# Altium project Rectifire_PFC_Solar.PrjPcb
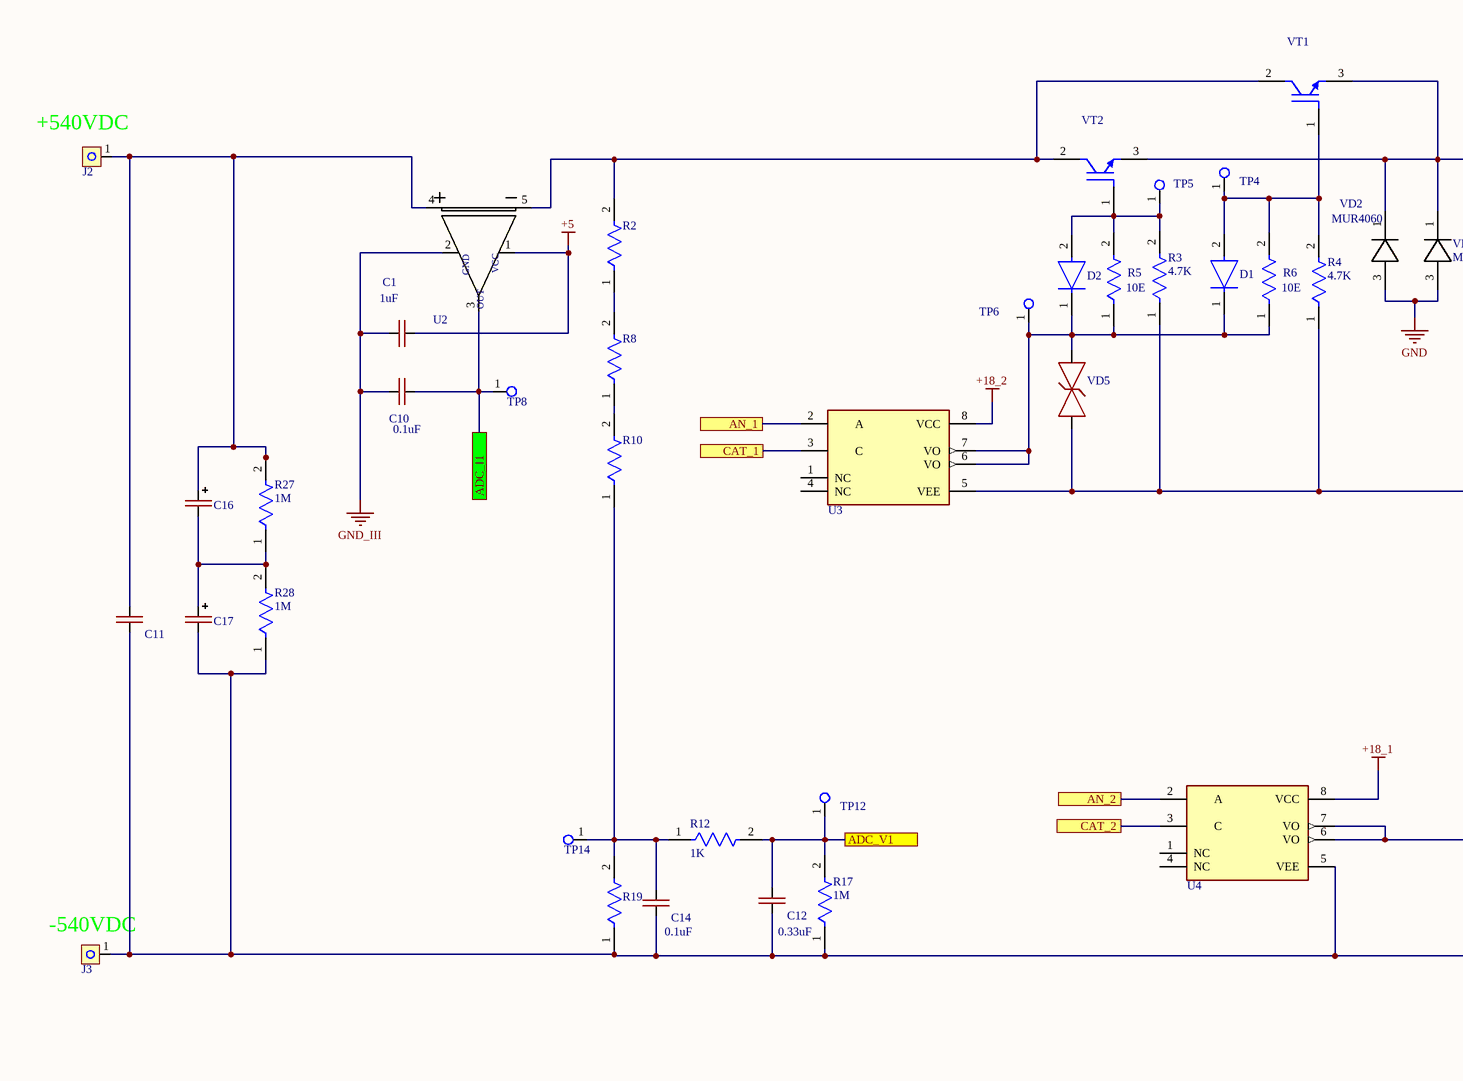
[diagram p0: Rectifire_PFC_Solar.SchDoc, top left]
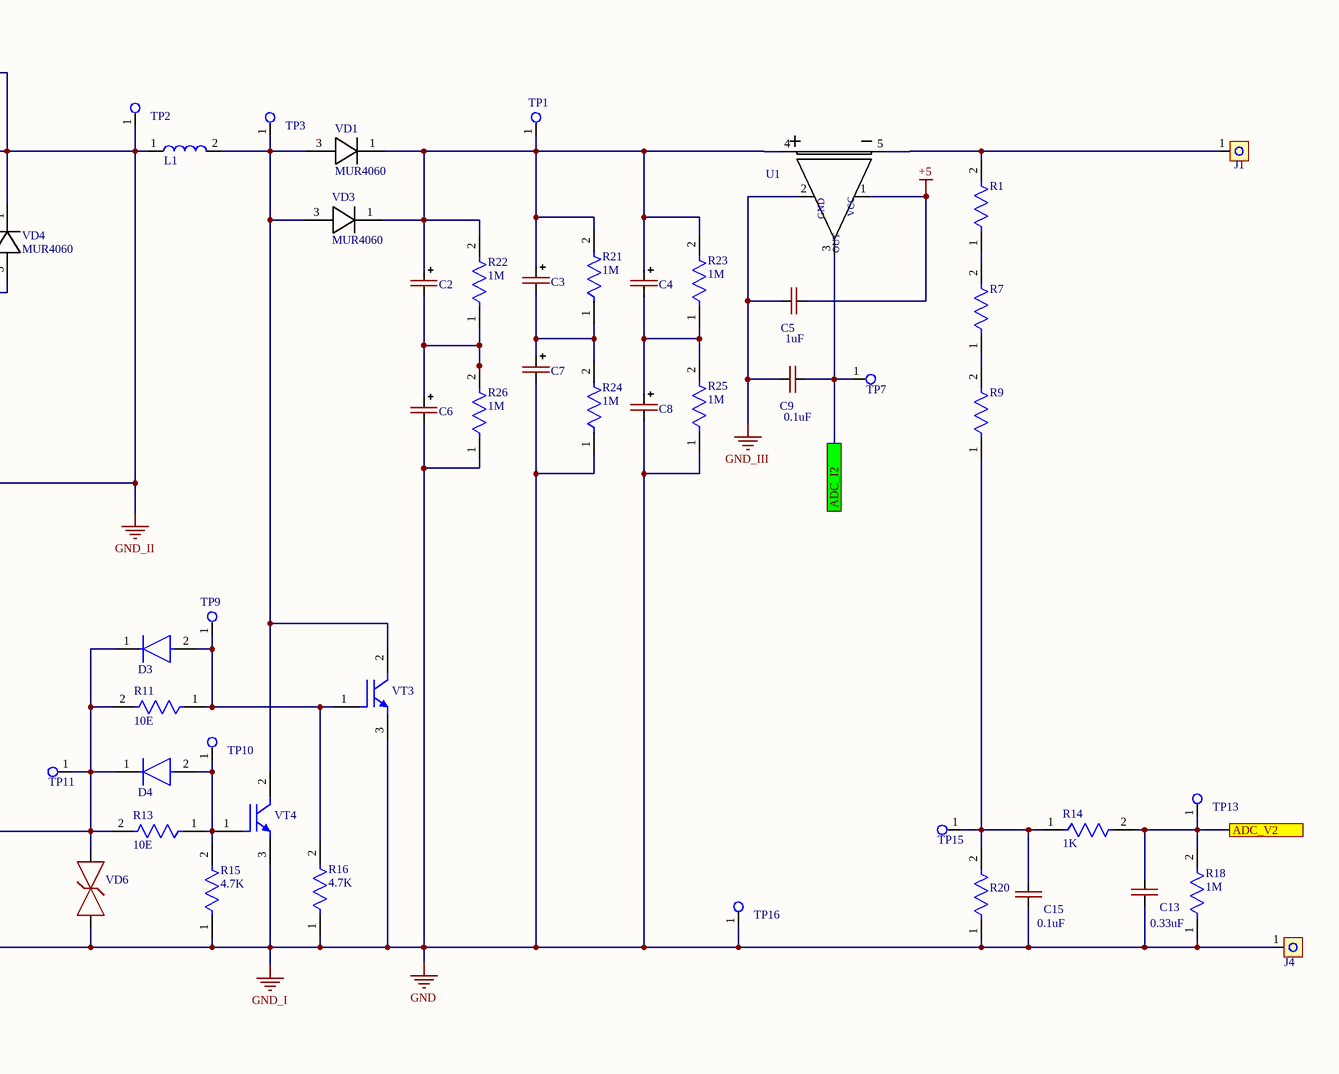
[diagram p1: Rectifire_PFC_Solar.SchDoc, top right]
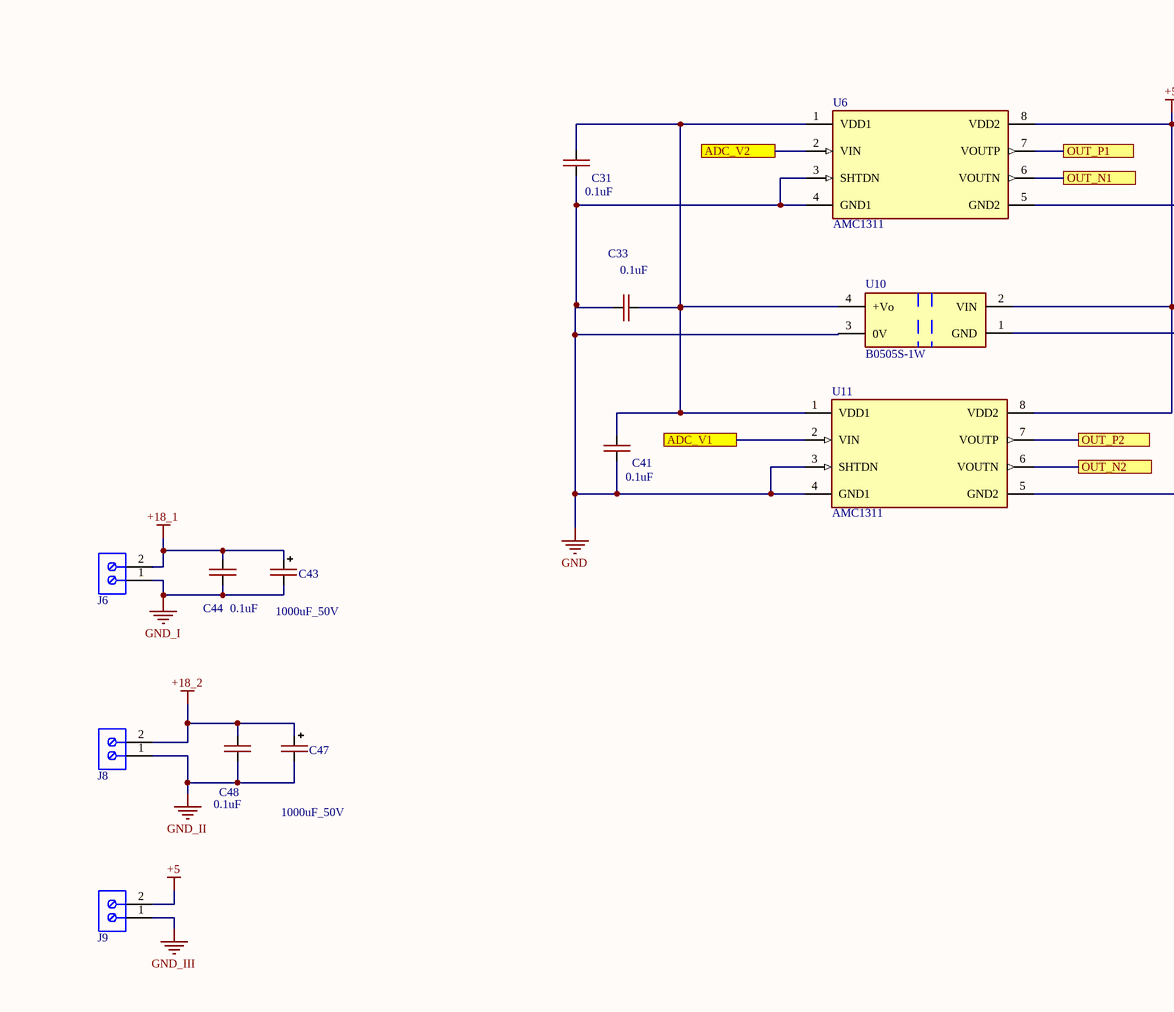
[diagram p2: Rectifire_PFC_Solar.SchDoc, bottom left]
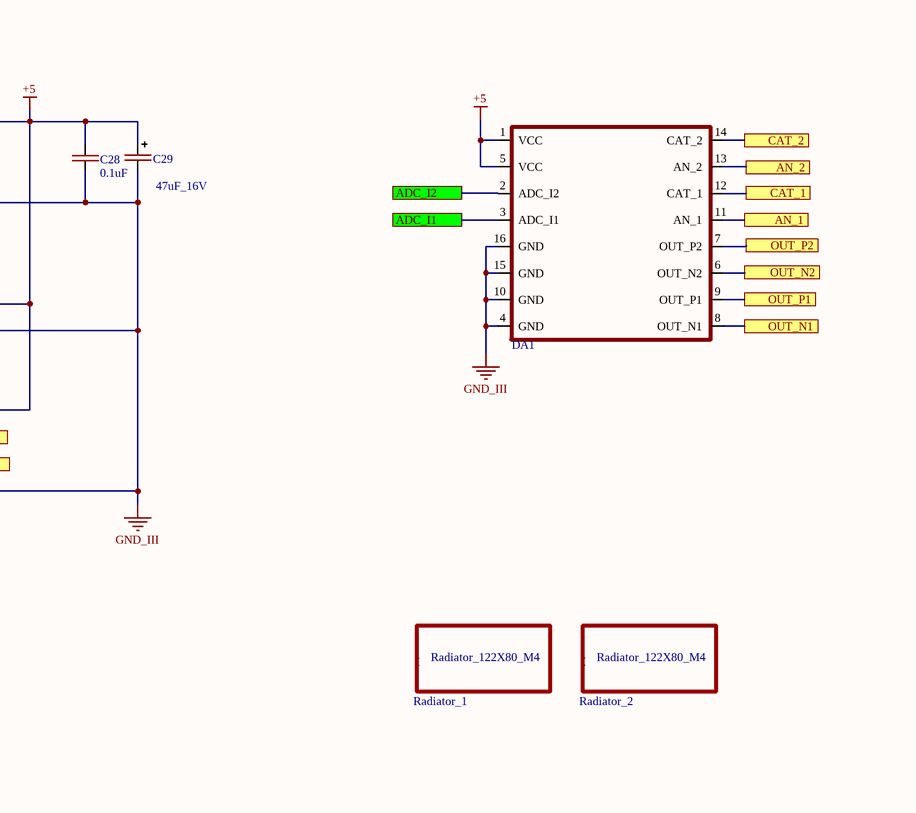
[diagram p3: Rectifire_PFC_Solar.SchDoc, bottom right]
1 sheet, 102 parts. Net scope: flat (ports and power ports of the same name join across sheets).
Board file: Rectifire_PFC_Solar.PcbDoc

## Sheet Rectifire_PFC_Solar.SchDoc
size A0; SheetNumber: 1; SheetTotal: 1; SPICEModelCacheFPQAHQWD: <root> / <DocumentId>FPQAHQWD</DocumentId> / </root>

### Parts
C1  1uF  [CAP-0805]
C2  CAP-POLAR  [CAP 100uF_500V 22x40mm]  (value not drawn)
C3  CAP-POLAR  [CAP 100uF_500V 22x40mm]  (value not drawn)
C4  CAP-POLAR  [CAP 100uF_500V 22x40mm]  (value not drawn)
C5  1uF  [CAP-0805]
C6  CAP-POLAR  [CAP 100uF_500V 22x40mm]  (value not drawn)
C7  CAP-POLAR  [CAP 100uF_500V 22x40mm]  (value not drawn)
C8  CAP-POLAR  [CAP 100uF_500V 22x40mm]  (value not drawn)
C9  0.1uF  [CAP-0805]
C10  0.1uF  [CAP-0805]
C11  CAP-NON-POLAR  [CAP_4.7uF_630V]  (value not drawn)
C12  0.33uF  [CAP-0805]
C13  0.33uF  [CAP-0805]
C14  0.1uF  [CAP-0805]
C15  0.1uF  [CAP-0805]
C16  CAP-POLAR  [CAP_POL_36X60]  (value not drawn)
C17  CAP-POLAR  [CAP_POL_36X60]  (value not drawn)
C28  0.1uF  [CAP-0805]
C29  47uF_16V  [CAP-TAN-D]
C31  0.1uF  [CAP-0805]
C33  0.1uF  [CAP-0805]
C41  0.1uF  [CAP-0805]
C43  1000uF_50V  [CAPPOL-16x25]
C44  0.1uF  [CAP-0805]
C47  1000uF_50V  [CAPPOL-16x25]
C48  0.1uF  [CAP-0805]
D1  US1G  [DO-214AA]  (value not drawn)
D2  US1G  [DO-214AA]  (value not drawn)
D3  US1G  [DO-214AA]  (value not drawn)
D4  US1G  [DO-214AA]  (value not drawn)
DA1  BOARD_PFC  [BOARD_PFC]  (value not drawn)
J1  MG_136_HT  [Conn_MEIGAN_MG136HT]  (value not drawn)
J2  MG_136_HT  [Conn_MEIGAN_MG136HT]  (value not drawn)
J3  MG_136_HT  [Conn_MEIGAN_MG136HT]  (value not drawn)
J4  MG_136_HT  [Conn_MEIGAN_MG136HT]  (value not drawn)
J6  691102710002  [691102710002]  (value not drawn)
J8  691102710002  [691102710002]  (value not drawn)
J9  691102710002  [691102710002]  (value not drawn)
L1  Coil  [30A_10uH]  (value not drawn)
R1  (no value)  [RES-2512]
R2  (no value)  [RES-2512]
R3  4.7K  [RES-0805]
R4  4.7K  [RES-0805]
R5  10E  [RES_SMD_1210_IPC_A]
R6  10E  [RES_SMD_1210_IPC_A]
R7  (no value)  [RES-2512]
R8  (no value)  [RES-2512]
R9  (no value)  [RES-2512]
R10  (no value)  [RES-2512]
R11  10E  [RES_SMD_1210_IPC_A]
R12  1K  [RES-0805]
R13  10E  [RES_SMD_1210_IPC_A]
R14  1K  [RES-0805]
R15  4.7K  [RES-0805]
R16  4.7K  [RES-0805]
R17  1M  [RES-0805]
R18  1M  [RES-0805]
R19  RES_1210  [RES_SMD_1210_IPC_B]  (value not drawn)
R20  RES_1210  [RES_SMD_1210_IPC_B]  (value not drawn)
R21  1M  [RES-2512]
R22  1M  [RES-2512]
R23  1M  [RES-2512]
R24  1M  [RES-2512]
R25  1M  [RES-2512]
R26  1M  [RES-2512]
R27  1M  [RES-2512]
R28  1M  [RES-2512]
Radiator_1  Radiator_122X80_M4  [Radiator_122X80_M4]  (value not drawn)
Radiator_2  Radiator_122X80_M4  [Radiator_122X80_M4]  (value not drawn)
TP1  Test_Point_PCB  [Test_Point]  (value not drawn)
TP2  Test_Point_PCB  [Test_Point]  (value not drawn)
TP3  Test_Point_PCB  [Test_Point]  (value not drawn)
TP4  Test_Point_PCB  [Test_Point]  (value not drawn)
TP5  Test_Point_PCB  [Test_Point]  (value not drawn)
TP6  Test_Point_PCB  [Test_Point]  (value not drawn)
TP7  Test_Point_PCB  [Test_Point]  (value not drawn)
TP8  Test_Point_PCB  [Test_Point]  (value not drawn)
TP9  Test_Point_PCB  [Test_Point]  (value not drawn)
TP10  Test_Point_PCB  [Test_Point]  (value not drawn)
TP11  Test_Point_PCB  [Test_Point]  (value not drawn)
TP12  Test_Point_PCB  [Test_Point]  (value not drawn)
TP13  Test_Point_PCB  [Test_Point]  (value not drawn)
TP14  Test_Point_PCB  [Test_Point]  (value not drawn)
TP15  Test_Point_PCB  [Test_Point]  (value not drawn)
TP16  Test_Point_PCB  [Test_Point]  (value not drawn)
U1  ACS758  [ACS758-100]  (value not drawn)
U2  ACS758  [ACS758-100]  (value not drawn)
U3  HCPL-3120  [HCPL-3120]  (value not drawn)
U4  HCPL-3120  [HCPL-3120]  (value not drawn)
U6  AMC1311  [FP-DWV0008A-MFG]
U10  B0505S-1W  [B0505S-1W]
U11  AMC1311  [FP-DWV0008A-MFG]
VD1  MUR4060  [TO-247-2]
VD2  MUR4060  [TO-247-2]
VD3  MUR4060  [TO-247-2]
VD4  MUR4060  [TO-247-2]
VD5  Suppressor  [DO-214AA]  (value not drawn)
VD6  Suppressor  [DO-214AA]  (value not drawn)
VT1  IGBT 60N120T  [TO-264-3]  (value not drawn)
VT2  IGBT 60N120T  [TO-264-3]  (value not drawn)
VT3  IGBT 60N120T  [TO-264-3]  (value not drawn)
VT4  IGBT 60N120T  [TO-264-3]  (value not drawn)

### Ports
ADC_I1, ADC_I2, ADC_V1, ADC_V2, AN_1, AN_2, CAT_1, CAT_2, OUT_N1, OUT_N2, OUT_P1, OUT_P2

### Nets
+5: C1.2 C5.2 C28.1 C29.1(+) DA1.1(VCC) DA1.5(VCC) J9.2 U1.1(+VCC) U2.1(+VCC) U6.8(VDD2) U10.2(VIN) U11.8(VDD2)
+18_1: C43.1(+) C44.2 J6.2 U4.8(VCC)
+18_2: C47.1(+) C48.2 J8.2 U3.8(VCC)
GND: C6.2(-) C7.2(-) C8.2(-) C11.1 C12.1 C13.1 C14.1 C15.1 C17.2(-) C31.1 C33.2 C41.1 C43.2(-) C44.1 J3.1 J4.1 J6.1 R15.1 R16.1 R17.1 R18.1 R19.1 R20.1 R24.1 R25.1 R26.1 R28.1 TP16.1(G9) U4.5(VEE) U6.3(SHTDN) U6.4(GND1) U10.3(0V) U11.3(SHTDN) U11.4(GND1) VD2.3 VD4.3 VD6.1(C) VT3.3(E) VT4.3(E)  [also labelled GND_I]
GND_II: C47.2(-) C48.1 J8.1 L1.1 R3.1 R4.1 TP2.1(G9) U3.5(VEE) VD2.1 VD4.1 VD5.1(C) VT1.3(E) VT2.3(E)
GND_III: C1.1 C5.1 C9.1 C10.1 C28.2 C29.2(-) DA1.4(GND) DA1.10(GND) DA1.15(GND) DA1.16(GND) J9.1 U1.2(GND) U2.2(GND) U6.5(GND2) U10.1(GND) U11.5(GND2)
NetC2_1: C2.1(+) C3.1(+) C4.1(+) R21.2 R22.2 R23.2 TP1.1(G9) U1.4(+IP) VD1.1 VD3.1
NetC2_2: C2.2(-) C6.1(+) R22.1 R26.2
NetC3_2: C3.2(-) C7.1(+) R21.1 R24.2
NetC4_2: C4.2(-) C8.1(+) R23.1 R25.2
NetC9_2: C9.2 DA1.2(ADC_I2) TP7.1(G9) U1.3(OUT) ; port ADC_I2
NetC10_2: C10.2 DA1.3(ADC_I1) TP8.1(G9) U2.3(OUT) ; port ADC_I1
NetC11_2: C11.2 C16.1(+) J2.1 R27.2 U2.4(+IP)
NetC12_2: C12.2 R12.2 R17.2 TP12.1(G9) U11.2(VIN) ; port ADC_V1
NetC13_2: C13.2 R14.2 R18.2 TP13.1(G9) U6.2(VIN) ; port ADC_V2
NetC14_2: C14.2 R10.1 R12.1 R19.2 TP14.1(G9)
NetC15_2: C15.2 R9.1 R14.1 R20.2 TP15.1(G9)
NetC16_2: C16.2(-) C17.1(+) R27.1 R28.2
NetC31_2: C31.2 C33.1 C41.2 U6.1(VDD1) U10.4(+Vo) U11.1(VDD1)
NetD1_1: D1.1(C) D2.1(C) R5.1 R6.1 TP6.1(G9) U3.6(VO) U3.7(VO) VD5.2(A)
NetD1_2: D1.2(A) R4.2 R6.2 TP4.1(G9) VT1.1(G)
NetD2_2: D2.2(A) R3.2 R5.2 TP5.1(G9) VT2.1(G)
NetD3_1: D3.1(C) D4.1(C) R11.2 R13.2 TP11.1(G9) U4.6(VO) U4.7(VO) VD6.2(A)
NetD3_2: D3.2(A) R11.1 R16.2 TP9.1(G9) VT3.1(G)
NetD4_2: D4.2(A) R13.1 R15.2 TP10.1(G9) VT4.1(G)
NetDA1_6: DA1.6(OUT_N2) U11.6(VOUTN) ; port OUT_N2
NetDA1_7: DA1.7(OUT_P2) U11.7(VOUTP) ; port OUT_P2
NetDA1_8: DA1.8(OUT_N1) U6.6(VOUTN) ; port OUT_N1
NetDA1_9: DA1.9(OUT_P1) U6.7(VOUTP) ; port OUT_P1
NetDA1_11: DA1.11(AN_1) U3.2(A) ; port AN_1
NetDA1_12: DA1.12(CAT_1) U3.3(C) ; port CAT_1
NetDA1_13: DA1.13(AN_2) U4.2(A) ; port AN_2
NetDA1_14: DA1.14(CAT_2) U4.3(C) ; port CAT_2
NetJ1_1: J1.1 R1.2 U1.5(-IP)
NetL1_2: L1.2 TP3.1(G9) VD1.3 VD3.3 VT3.2(C) VT4.2(C)
NetR1_1: R1.1 R7.2
NetR2_1: R2.1 R8.2
NetR2_2: R2.2 U2.5(-IP) VT1.2(C) VT2.2(C)
NetR7_1: R7.1 R9.2
NetR8_1: R8.1 R10.2

Not connected (* = marked no-connect by the designer): U3 1(NC) 4(NC); U4 1(NC) 4(NC)

### Notes on the sheet
- (near J2) +540VDC
- (near J3) -540VDC
- (in symbol ACS758) VCC

### Library data of the parts
C1 C5 C9 C10 C12-C15 C28 C31 C33 C41 C44 C48 = CAP-NON-POLAR
C29 C43 C47 = CAP-POLAR
J1-J4 = Connector_MEIGAN_MG136HT
J6 J8 J9 = 691102710002: WR-TBL Series 102 Horizontal Entry Modular, THT, pitch 5mm, 2p; Manufacturer: Wurth Elektronik; Modularity: Yes; Rated Current: 15A; Working Voltage: 250V; ComponentLink1Description: Website Link; ComponentLink1URL: https://www.we-online.com/redexpert/article/691102710002?ad; ComponentLink2Description: Datasheet Link; ComponentLink2URL: https://www.we-online.com/redexpert/spec/691102710002?ad; Manufacturer Part Number: 691102710002; Category: Terminal Blocks; Match Code: WR-TBL; Mount: Through Hole; Operating Temperature Max: 105°C; Operating Temperature Min: -40°C; Packaging: Box; Application: Pressure Clamp; Number of Pins: 2; Number of Rows: 1; Orientation: Horizontal; Pitch: 5mm
R1-R4 R7-R10 R12 R14-R18 = RES-CONST
R5 R6 R11 R13 = RES_1210
R21-R28 = RES-CONST: 4.7K
TP1-TP16 = TP_PCB?: Test_Point
VT1-VT4 = IGBT 60N120T: IGBT 60N120T TO-264-3